# Altium schematic sheet Monotith-Small Battery_6.0.SchDoc
size A4
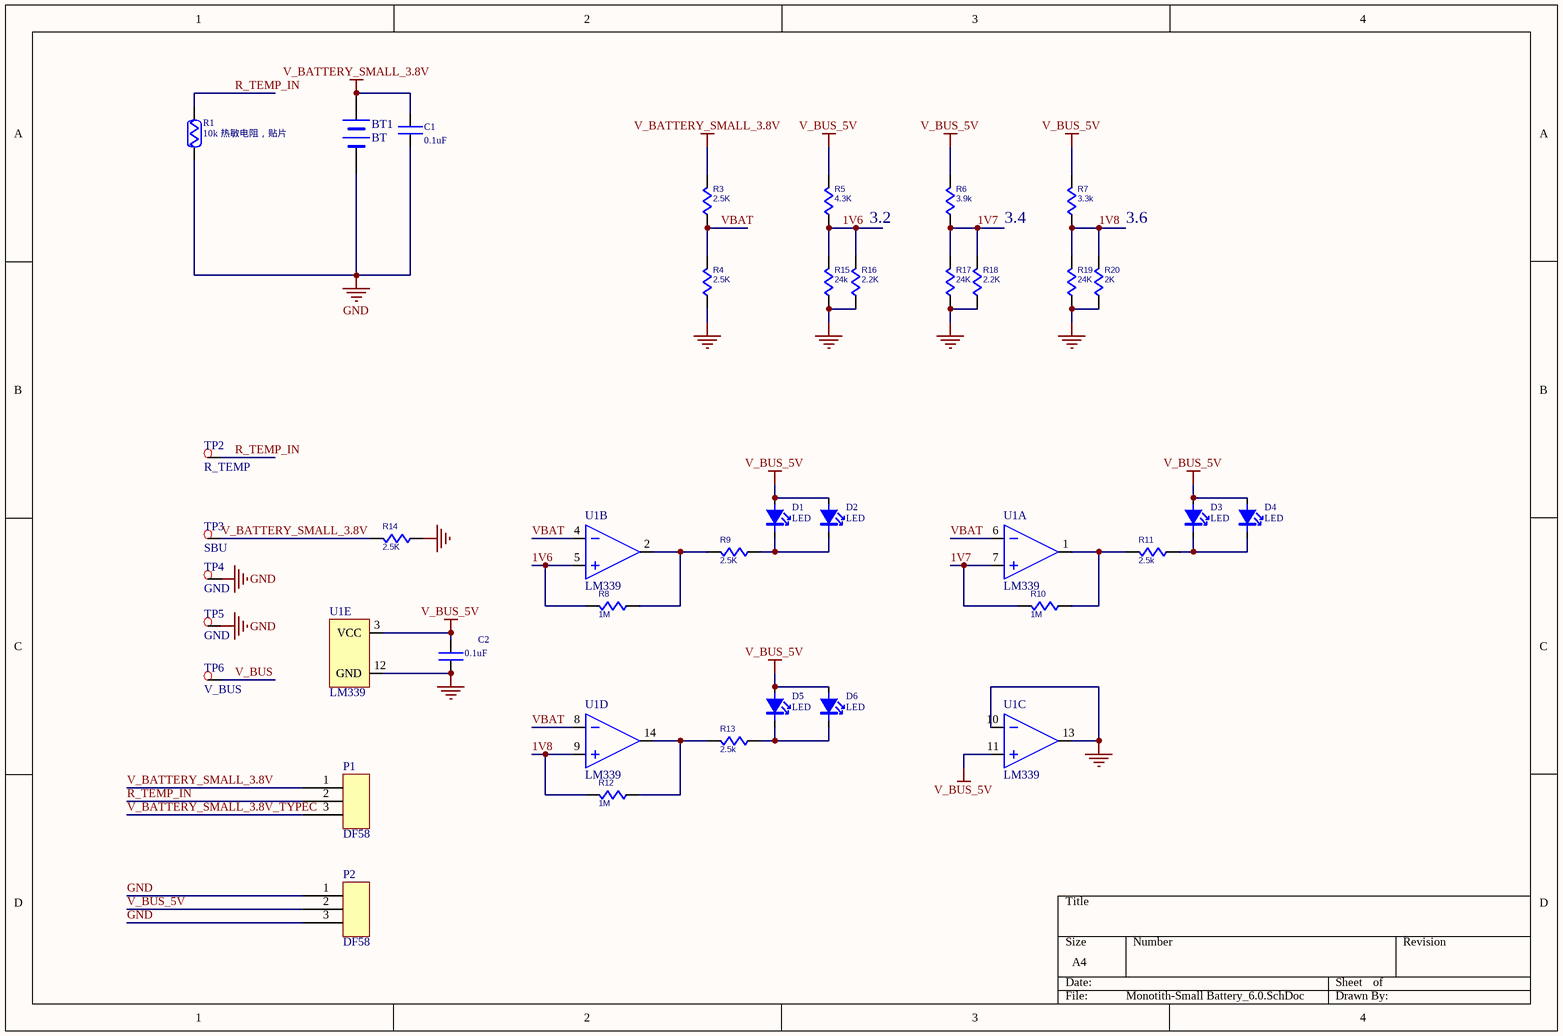
[diagram p0: Monotith-Small Battery_6.0.SchDoc]

## Parts
BT1  BT  [SIP1 - 0.5]
C1  0.1uF  [C0402]
C2  0.1uF  [C0402]
D1  LED  [LED0402]
D2  LED  [LED0402]
D3  LED  [LED0402]
D4  LED  [LED0402]
D5  LED  [LED0402]
D6  LED  [LED0402]
P1  DF58  [DF58-3P]
P2  DF58  [DF58-3P]
R1  10k 热敏电阻，贴片  [NTC 0402]
R3  2.5K  [R0402]
R4  2.5K  [R0402]
R5  4.3K  [R0402]
R6  3.9k  [R0402]
R7  3.3k  [R0402]
R8  1M  [R0402]
R9  2.5K  [R0402]
R10  1M  [R0402]
R11  2.5k  [R0402]
R12  1M  [R0402]
R13  2.5k  [R0402]
R14  2.5K  [R0402]
R15  24k  [R0402]
R16  2.2K  [R0402]
R17  24K  [R0402]
R18  2.2K  [R0402]
R19  24K  [R0402]
R20  2K  [R0402]
TP2  R_TEMP  [SIP1 - 0.5]
TP3  SBU  [SIP1 - 0.5]
TP4  GND  [SIP1 - 0.5]
TP5  GND  [SIP1 - 0.5]
TP6  V_BUS  [SIP1 - 0.5]
U1  LM339  [TSOP65P640X120-14N]  (parts A,B,C,D,E of 5)

## Nets
GND: BT1.2(-) C1.2 C2.2 P2.1 P2.3 R1.2 R4.2 R14.2 R15.2 R16.2 R17.2 R18.2 R19.2 R20.2 TP4.1 TP5.1 U1.10(IN+) U1.12(GND) U1.13(OUT)
V_BATTERY_SMALL_3.8V: BT1.1(+) C1.1 P1.1 R3.1 R14.1 TP3.1
V_BUS_5V: C2.1 D1.A D2.A D3.A D4.A D5.A D6.A P2.2 R5.1 R6.1 R7.1 U1.3(VCC) U1.11(IN-)
1V6: R5.2 R8.1 R15.1 R16.1 U1.5(IN+)
1V7: R6.2 R10.1 R17.1 R18.1 U1.7(IN+)
1V8: R7.2 R12.1 R19.1 R20.1 U1.9(IN+)
R_TEMP_IN: P1.2 R1.1 TP2.1
V_BATTERY_SMALL_3.8V_TYPEC: P1.3
V_BUS: TP6.1
VBAT: R3.2 R4.1 U1.4(IN-) U1.6(IN-) U1.8(IN-)
NetD1_K: D1.K D2.K R9.2
NetD3_K: D3.K D4.K R11.2
NetD5_K: D5.K D6.K R13.2
NetR8_2: R8.2 R9.1 U1.2(OUT)
NetR10_2: R10.2 R11.1 U1.1(OUT)
NetR12_2: R12.2 R13.1 U1.14(OUT)

## Notes on the sheet
- 3.2
- 3.4
- 3.6

## Library data of the parts
BT1 = BT: Battery
C1 C2 = CAP: 50V; Tolerance: 20%; Value: 0.1uF
R1 = NTC: Resistor; Tolerance: 5%; Value: 10k 热敏电阻，贴片
R3-R20 = RESISTOR
  R3 R4 R9 R14: Manufacturer Part Number: 2.5K
  R8 R10 R12: Manufacturer Part Number: 1M
  R11 R13: Manufacturer Part Number: 2.5k
TP2-TP6 = Testpoint